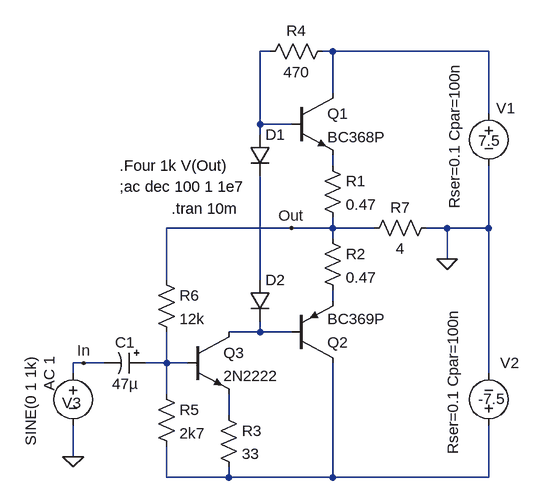
[diagram p0: schematic Mini.asc]
Mini.asc, the LTspice schematic file:
Version 4
SHEET 1 880 748
WIRE -256 560 -256 544
WIRE -256 688 -256 640
WIRE -240 544 -256 544
WIRE -208 544 -240 544
WIRE -112 416 -112 336
WIRE -112 544 -144 544
WIRE -112 544 -112 496
WIRE -112 592 -112 544
WIRE -112 720 -112 672
WIRE -80 544 -112 544
WIRE -16 624 -16 592
WIRE -16 720 -112 720
WIRE -16 720 -16 704
WIRE 32 176 32 64
WIRE 32 192 32 176
WIRE 32 416 32 256
WIRE 32 496 -16 496
WIRE 32 496 32 480
WIRE 48 64 32 64
WIRE 80 176 32 176
WIRE 80 336 -112 336
WIRE 80 496 32 496
WIRE 144 64 128 64
WIRE 144 128 144 64
WIRE 144 240 144 224
WIRE 144 336 80 336
WIRE 144 336 144 320
WIRE 144 352 144 336
WIRE 144 448 144 432
WIRE 144 720 -16 720
WIRE 144 720 144 544
WIRE 208 336 144 336
WIRE 320 336 288 336
WIRE 320 384 320 336
WIRE 384 64 144 64
WIRE 384 160 384 64
WIRE 384 336 320 336
WIRE 384 336 384 240
WIRE 384 560 384 336
WIRE 384 720 144 720
WIRE 384 720 384 640
FLAG 320 384 0
FLAG -256 688 0
FLAG 80 336 Out
FLAG -240 544 In
SYMBOL diode 16 192 R0
WINDOW 3 24 72 Invisible 0
SYMATTR Value 1N914
SYMATTR InstName D1
SYMBOL diode 16 416 R0
WINDOW 3 24 72 Invisible 0
SYMATTR Value 1N914
SYMATTR InstName D2
SYMBOL pnp2 80 544 M180
SYMATTR InstName Q2
SYMATTR Value BC369P
SYMBOL npn2 80 128 R0
SYMATTR InstName Q1
SYMATTR Value BC368P
SYMBOL npn2 -80 496 R0
SYMATTR InstName Q3
SYMATTR Value 2N2222
SYMBOL res 128 224 R0
SYMATTR InstName R1
SYMATTR Value 0.47
SYMATTR SpiceLine tol=1 pwr=0.1
SYMBOL res 128 336 R0
SYMATTR InstName R2
SYMATTR Value 0.47
SYMATTR SpiceLine tol=1 pwr=0.1
SYMBOL res -32 608 R0
SYMATTR InstName R3
SYMATTR Value 33
SYMATTR SpiceLine tol=1 pwr=0.1
SYMBOL res 32 80 R270
WINDOW 0 32 56 VTop 0
WINDOW 3 0 56 VBottom 0
SYMATTR InstName R4
SYMATTR Value 470
SYMATTR SpiceLine tol=1 pwr=0.1
SYMBOL res -128 576 R0
SYMATTR InstName R5
SYMATTR Value 2k7
SYMATTR SpiceLine tol=1 pwr=0.1
SYMBOL res -128 400 R0
SYMATTR InstName R6
SYMATTR Value 12k
SYMATTR SpiceLine tol=1 pwr=0.1
SYMBOL res 192 352 R270
WINDOW 0 32 56 VTop 0
WINDOW 3 0 56 VBottom 0
SYMATTR InstName R7
SYMATTR Value 4
SYMATTR SpiceLine tol=1 pwr=0.1
SYMBOL voltage 384 144 R0
WINDOW 0 12 7 Left 0
WINDOW 3 -16 57 Left 0
WINDOW 123 0 0 Left 0
WINDOW 39 -53 -64 VRight 0
SYMATTR InstName V1
SYMATTR Value 7.5
SYMATTR SpiceLine Rser=0.1 Cpar=100n
SYMBOL voltage 384 656 M180
WINDOW 0 18 112 Left 0
WINDOW 3 -16 57 Left 0
WINDOW 123 0 0 Left 0
WINDOW 39 -55 -29 VRight 0
SYMATTR InstName V2
SYMATTR Value -7.5
SYMATTR SpiceLine Rser=0.1 Cpar=100n
SYMBOL voltage -256 544 R0
WINDOW 0 -17 61 Left 0
WINDOW 3 -65 -10 VRight 0
WINDOW 123 -37 -10 VRight 0
SYMATTR InstName V3
SYMATTR Value SINE(0 1 1k)
SYMATTR Value2 AC 1
SYMATTR SpiceLine Rser=1k
SYMBOL polcap -144 528 R90
WINDOW 0 0 32 VBottom 0
WINDOW 3 32 32 VTop 0
SYMATTR InstName C1
SYMATTR Value 47µ
SYMATTR Description Capacitor
SYMATTR Type cap
SYMATTR SpiceLine V=16 Irms=155m Rser=0.8 MTBF=2000 Lser=0 mfg="Nichicon" pn="UPL1C470MAH" type="Al electrolytic" ppPkg=1
TEXT -104 306 Left 0 !.tran 10m
TEXT -184 272 Left 0 !;ac dec 100 1 1e7
TEXT -184 240 Left 0 !.Four 1k V(Out)

The netlist it stands for:
* Mini.asc
D1 N004 N005 1N914
D2 N005 N006 1N914
Q2 N002 N006 N009 0 BC369P
Q1 N007 N004 N008 0 BC368P
Q3 N006 N001 N003 0 2N2222
R1 N008 Out 0.47 tol=1 pwr=0.1
R2 Out N009 0.47 tol=1 pwr=0.1
R3 N003 N002 33 tol=1 pwr=0.1
R4 N004 N007 470 tol=1 pwr=0.1
R5 N001 N002 2k7 tol=1 pwr=0.1
R6 Out N001 12k tol=1 pwr=0.1
R7 Out 0 4 tol=1 pwr=0.1
V1 N007 0 7.5 Rser=0.1 Cpar=100n
V2 N002 0 -7.5 Rser=0.1 Cpar=100n
V3 In 0 SINE(0 1 1k) AC 1 Rser=1k
C1 N001 In 47µ V=16 Irms=155m Rser=0.8 MTBF=2000 Lser=0 mfg="Nichicon" pn="UPL1C470MAH" type="Al electrolytic" ppPkg=1
.model D D
.lib standard.dio
.model NPN NPN
.model PNP PNP
.lib standard.bjt
.tran 10m
;ac dec 100 1 1e7
.Four 1k V(Out)
.backanno
.end